# Altium schematic sheet BUS.SchDoc
size A4
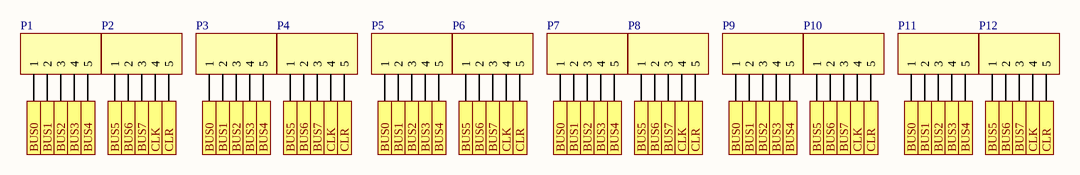
[diagram p0: BUS.SchDoc]

## Parts
P1  Header 5  [HDR1X5]  (value not drawn)
P2  Header 5  [HDR1X5]  (value not drawn)
P3  Header 5  [HDR1X5]  (value not drawn)
P4  Header 5  [HDR1X5]  (value not drawn)
P5  Header 5  [HDR1X5]  (value not drawn)
P6  Header 5  [HDR1X5]  (value not drawn)
P7  Header 5  [HDR1X5]  (value not drawn)
P8  Header 5  [HDR1X5]  (value not drawn)
P9  Header 5  [HDR1X5]  (value not drawn)
P10  Header 5  [HDR1X5]  (value not drawn)
P11  Header 5  [HDR1X5]  (value not drawn)
P12  Header 5  [HDR1X5]  (value not drawn)

## Ports
BUS0, BUS1, BUS2, BUS3, BUS4, BUS5, BUS6, BUS7, CLK, CLR

## Nets
BUS0: P1.1 P3.1 P5.1 P7.1 P9.1 P11.1 ; port BUS0
BUS1: P1.2 P3.2 P5.2 P7.2 P9.2 P11.2 ; port BUS1
BUS2: P1.3 P3.3 P5.3 P7.3 P9.3 P11.3 ; port BUS2
BUS3: P1.4 P3.4 P5.4 P7.4 P9.4 P11.4 ; port BUS3
BUS4: P1.5 P3.5 P5.5 P7.5 P9.5 P11.5 ; port BUS4
BUS5: P2.1 P4.1 P6.1 P8.1 P10.1 P12.1 ; port BUS5
BUS6: P2.2 P4.2 P6.2 P8.2 P10.2 P12.2 ; port BUS6
BUS7: P2.3 P4.3 P6.3 P8.3 P10.3 P12.3 ; port BUS7
CLK: P2.4 P4.4 P6.4 P8.4 P10.4 P12.4 ; port CLK
CLR: P2.5 P4.5 P6.5 P8.5 P10.5 P12.5 ; port CLR

## Library data of the parts
P1-P12 = Header 5: Header, 5-Pin; LatestRevisionDate: 17-Jul-2002; LatestRevisionNote: Re-released for DXP Platform.; Publisher: Altium Limited